# EAGLE design padboard-1 (EAGLE 8.3.2)
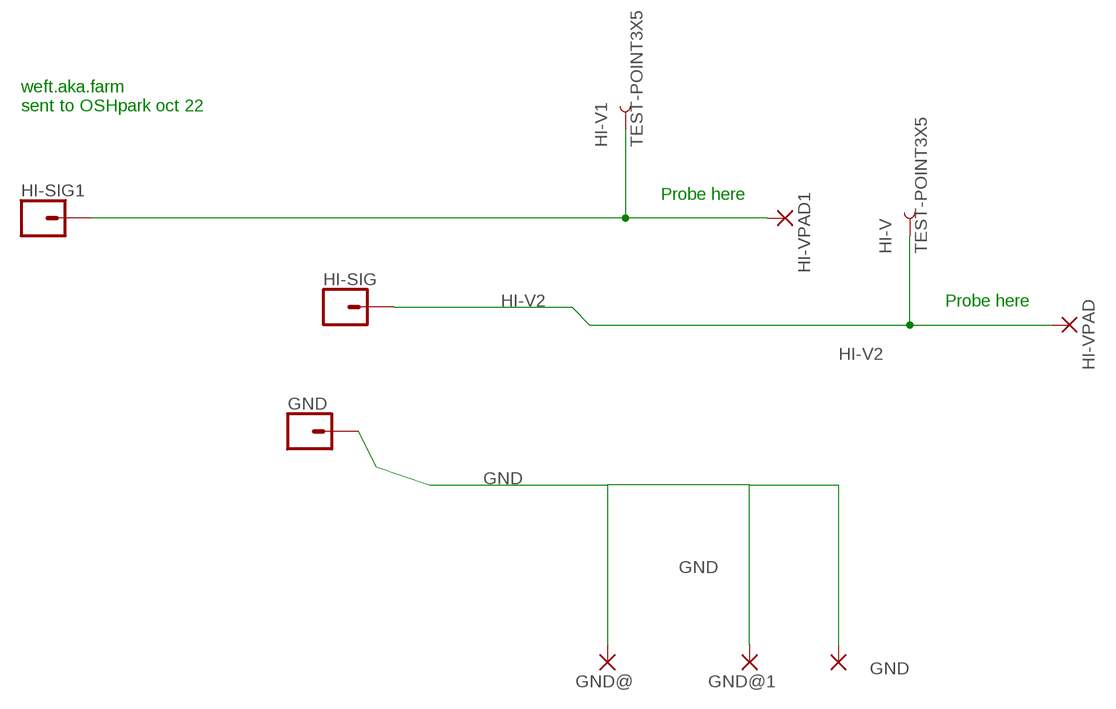
[diagram p0: schematic, sheet 1]

## Parts
GND  CONN_01PTH_LONGPAD  [1X01_LONGPAD]
GND@  WIREPADSMD5-2,5  [5-2,5]
GND@1  WIREPADSMD5-2,5  [5-2,5]
GND@2  WIREPADSMD5-2,5  [5-2,5]
HI-SIG  CONN_01PTH_LONGPAD  [1X01_LONGPAD]
HI-SIG1  CONN_01PTH_LONGPAD  [1X01_LONGPAD]
HI-V  TEST-POINT3X5  [PAD.03X.05]
HI-V1  TEST-POINT3X5  [PAD.03X.05]
HI-VPAD  WIREPADSMD5-2,5  [5-2,5]
HI-VPAD1  WIREPADSMD5-2,5  [5-2,5]

## Nets
GND: GND@1.1(P) GND@2.1(P) GND@.1(P)
HI-V1: HI-SIG1.1 HI-V1.P$1 HI-VPAD1.1(P)
HI-V2: HI-SIG.1 HI-V.P$1 HI-VPAD.1(P)
N$1: GND.1

## Notes on the sheet
- weft.aka.farm
  sent to OSHpark oct 22
- Probe here
- Probe here

## Library data of the parts
GND HI-SIG HI-SIG1 = SparkFun-Connectors:CONN_01: Single connection point. Often used as Generic Header-pin footprint for 0.1 inch spaced/style header connections On any of the 0.1 inch spaced packages, you can populate with these: Break Away Headers - Straight <https://www.sparkfun.com/products/116> (PRT-00116) Break Away Male Headers - Right Angle <https://www.sparkfun.com/products/553> (PRT-00553) Female Headers <https://www.sparkfun.com/products/115> (PRT-00115) Break Away Headers - Machine Pin <https://www.sparkfun.com/products/117> (PRT-00117) Break Away Female Headers - Swiss Machine Pin <https://www.sparkfun.com/products/743> (PRT-00743) This device is also useful as a general connection point to wire up your design to another part of your project. Our various solder wires solder well into these plated through hole pads. Hook-Up Wire - Assortment (Stranded, 22 AWG) <https://www.sparkfun.com/products/11375> (PRT-11375) Hook-Up Wire - Assortment (Solid Core, 22 AWG) <https://www.sparkfun.com/products/11367> (PRT-11367) View the entire wire category on our website here <https://www.sparkfun.com/categories/141> Special notes: SMTSO-256-ET is a "flush mount" nut for a 4-40 screw. We mostly use this on specialty testbeds; it is a nice way to connect hardware to your PCB at an adjustable hieght. Also note, the SNAP packages are for using a snappable style connector. We sell a baggie of snaps and they are also used on two LilyPad designs: Snap Assortment - 30 pack (male and female) <https://www.sparkfun.com/products/11347> (DEV-11347) LilyPad Arduino SimpleSnap <https://www.sparkfun.com/products/10941> (DEV-10941) LilyPad SimpleSnap Protoboard <https://www.sparkfun.com/products/10940> (DEV-10940)
GND@ GND@1 GND@2 HI-VPAD HI-VPAD1 = wirepad:WIREPAD: Wire PAD connect wire on PCB
HI-V HI-V1 = SparkFun-Passives:TEST-POINT: Bare copper test points for troubleshooting or ICT

## Board
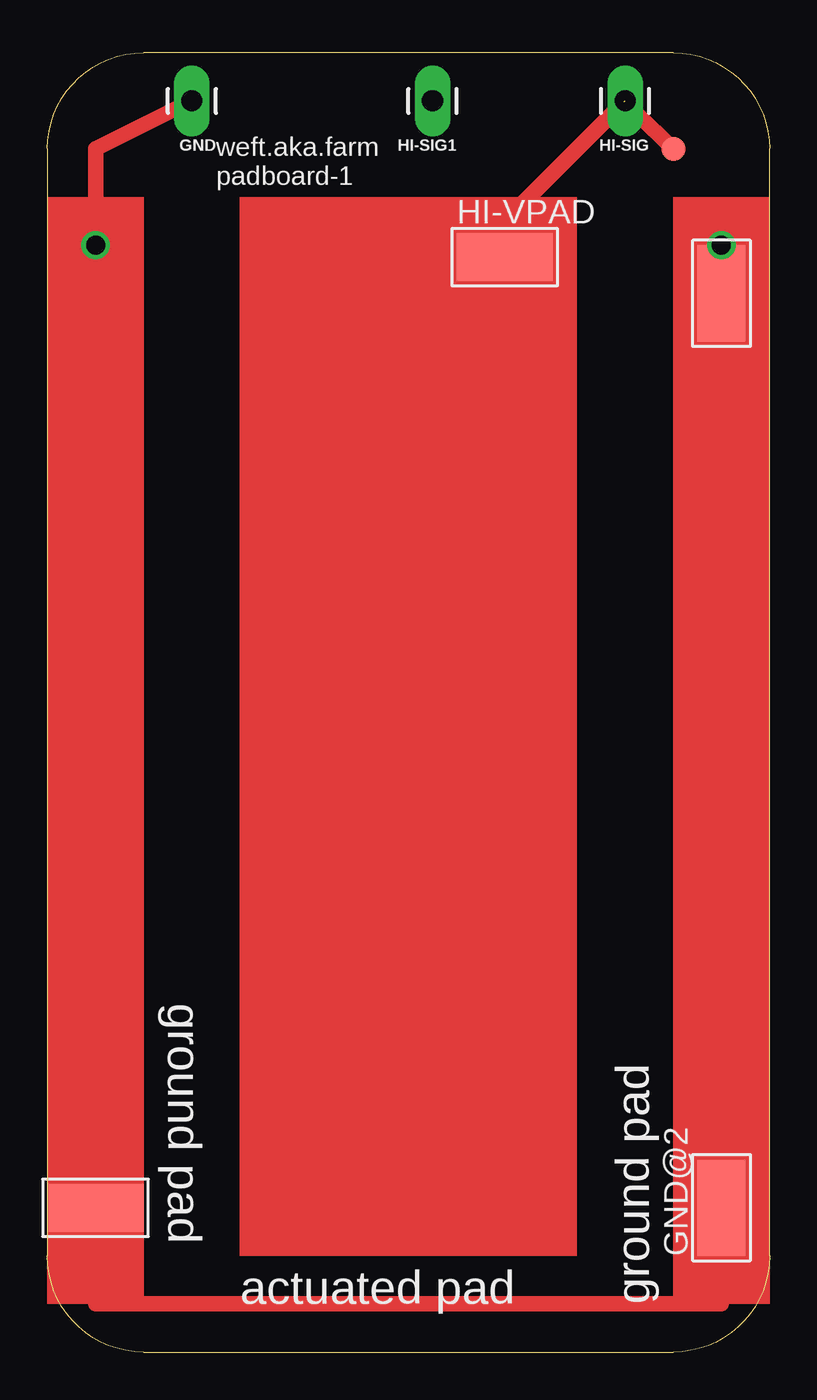
[diagram p1: board, top side]
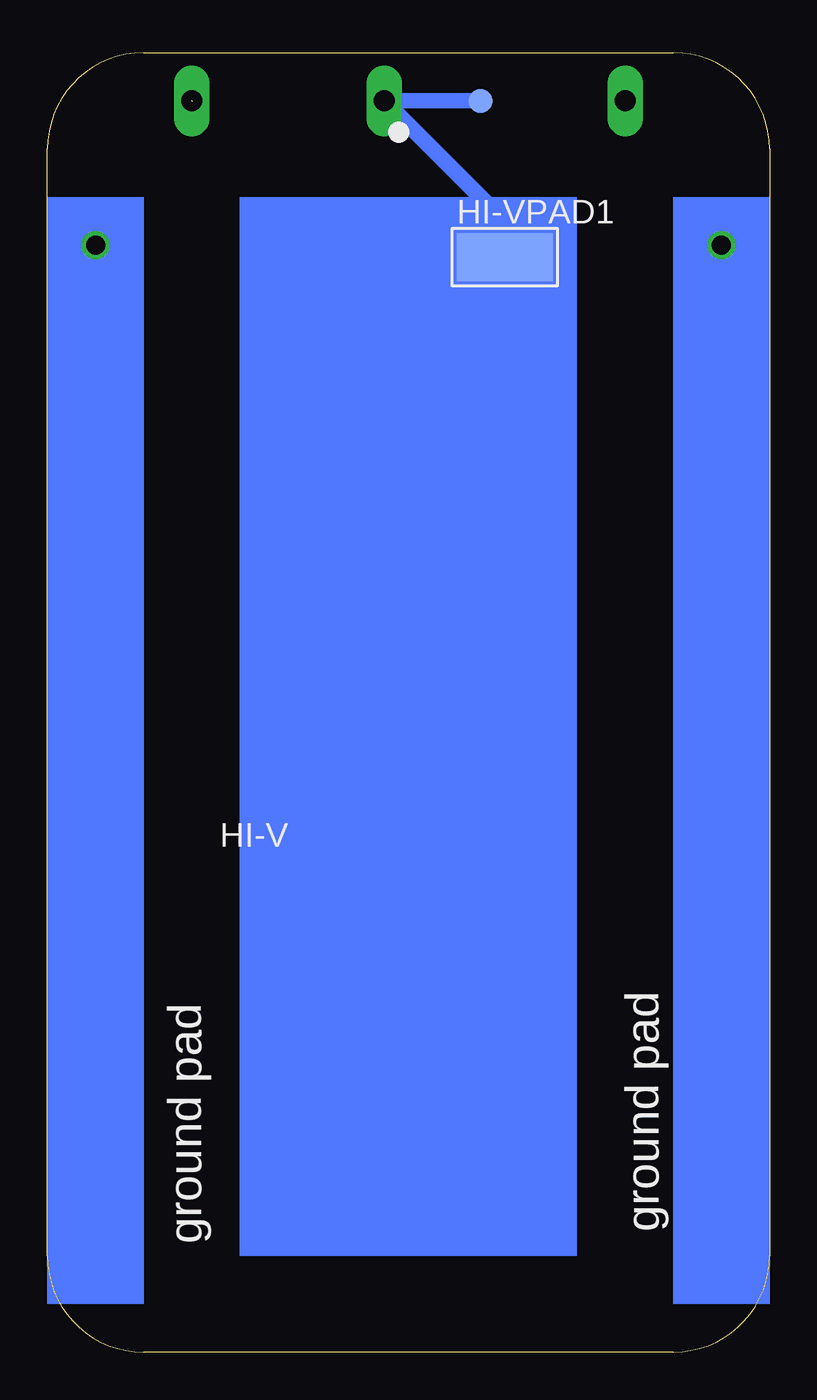
[diagram p2: board, bottom side, seen from below]

Size 38.1 x 68.58 mm. Coordinates in mm from the lower left corner, seen from the top.
Outline: 5.08,0 33.02,0 arc90 38.1,5.08 38.1,63.5 arc90 33.02,68.58 5.08,68.58 arc90 0,63.5 0,5.08 arc90 5.08,0
Copper layers (1*16): Top 0.0356mm / dielectric 1.5011mm / Bottom 0.0356mm
Design rules "LaenPCBOrder": minimum track width 6mil, minimum drill 13mil, track to track 6mil, track to pad 6mil, pad to pad 6mil, via to via 6mil, smd to smd 6mil, copper to edge 15mil, drill to drill 6mil, minimum pad ring 7mil, minimum via ring 7mil, stop-mask expansion 3mil, vias tented up to drill 0mil, thermal gap 10mil

### Footprints (pad centres in the part's own frame; a part is rotated, then mirrored left to right if it is on the bottom)
1X01_LONGPAD = drill 1.118 pad 1.88 long: 1 0,0
5-2,5 = smd 2.54 x 5.08: 1 0,0
PAD.03X.05 = smd 1.27 x 1.27: P$1 0,0

### Placement (x,y rotation side)
GND  7.62,66.04 180 top
GND@  35.56,55.88 180 top
GND@1  2.54,7.62 270 top
GND@2  35.56,7.62 0 top
HI-SIG  30.48,66.04 180 top
HI-SIG1  20.32,66.04 180 top
HI-V  33.02,63.5 0 top
HI-V1  15.24,66.04 0 bottom
HI-VPAD  24.13,57.78 270 top
HI-VPAD1  13.97,57.78 270 bottom

### Tracks (layer width: path | path; a pad name or v marks a point on that pad's centre or on a via)
GND
  Top 0.813: GND@1.1 2.54,2.54 35.56,2.54 GND@2.1 GND@.1
HI-V1
  Bottom 0.813: HI-VPAD1.1 13.97,59.69 HI-SIG1.1 HI-V1.P$1
HI-V2  (1 unrouted)
  Top 0.813: 30.43,65.99 HI-V.P$1 | 30.43,65.99 30.39,66.04 | HI-VPAD.1 24.13,59.69 30.43,65.99
N$2  (via drill 1)
  Top 0.813: v2.54,58.42 2.54,63.5 7.62,66.04
N$3  (via drill 1)
  other vias: 35.56,58.42
(copper drawn outside any net)
  shapes: Bottom area x3, Top area x3

### Text on the board
tNames: weft.aka.farm / padboard-1 | ground pad | actuated pad | ground pad
bNames: HI-V | ground pad | ground pad